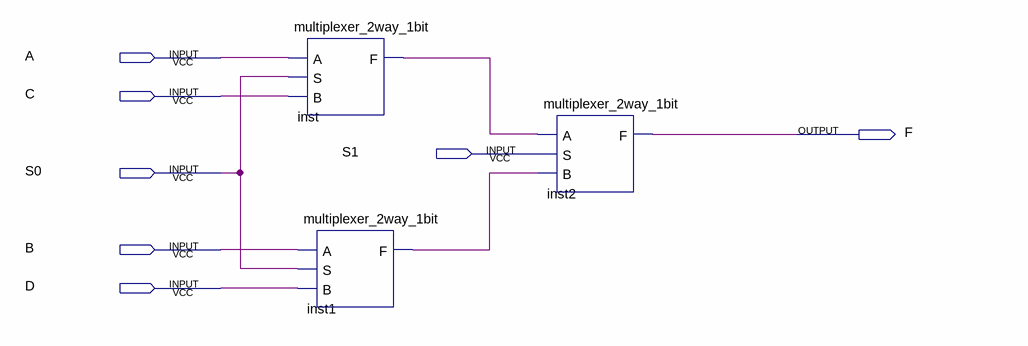
[diagram p0: schematic sheet]
// Quartus schematic multiplexer_4way_1bit.bdf as structural Verilog: 3 symbols, 7 pins
module multiplexer_4way_1bit (
  input  A,
  input  C,
  input  S1,
  input  S0,
  input  B,
  input  D,
  output F
);

  wire inst1_f, inst_f;

  multiplexer_2way_1bit inst (.A(A), .S(S0), .B(C), .F(inst_f));
  multiplexer_2way_1bit inst1 (.A(B), .S(S0), .B(D), .F(inst1_f));
  multiplexer_2way_1bit inst2 (.A(inst_f), .S(S1), .B(inst1_f), .F(F));
endmodule
